# Altium schematic sheet microcontroller.SchDoc: Microcontroller
size A4; Author: Pietro Lorefice; DocumentNumber: 2; Revision: A; SheetNumber: 2; SheetTotal: 3
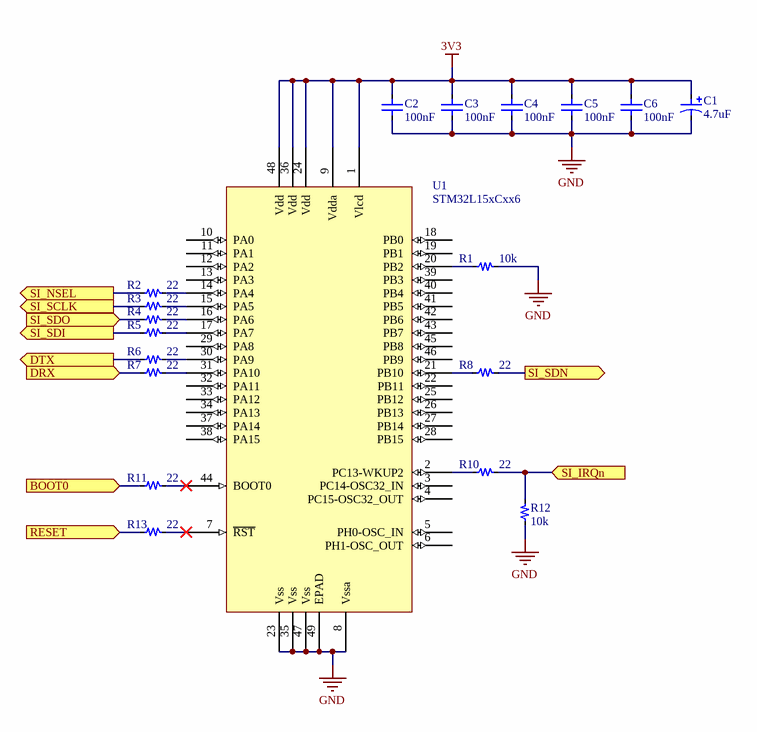
[diagram p0: microcontroller.SchDoc]

## Parts
C1  4.7uF  [0603_[1608]]
C2  100nF  [0402_[1005]]
C3  100nF  [0402_[1005]]
C4  100nF  [0402_[1005]]
C5  100nF  [0402_[1005]]
C6  100nF  [0402_[1005]]
R1  10k  [0402_[1005]]
R2  22  [0402_[1005]]
R3  22  [0402_[1005]]
R4  22  [0402_[1005]]
R5  22  [0402_[1005]]
R6  22  [0402_[1005]]
R7  22  [0402_[1005]]
R8  22  [0402_[1005]]
R10  22  [0402_[1005]]
R11  22  [0402_[1005]]
R12  10k  [0402_[1005]]
R13  22  [0402_[1005]]
U1  STM32L15xCxx6  [QFN50P700X700X60_HS-49N]

## Ports
BOOT0 (in), DRX (in), DTX (out), RESET (in), SI_IRQn (in), SI_NSEL (out), SI_SCLK (out), SI_SDI (out), SI_SDN (out), SI_SDO (in)

## Nets
3V3: C1.1 C2.2 C3.2 C4.2 C5.2 C6.2 U1.1(Vlcd) U1.9(Vdda) U1.24(Vdd) U1.36(Vdd) U1.48(Vdd)
GND: C1.2 C2.1 C3.1 C4.1 C5.1 C6.1 R1.2 R12.1 U1.8(Vssa) U1.23(Vss) U1.35(Vss) U1.47(Vss) U1.49(EPAD)
BOOT0: R11.1 ; port BOOT0
DRX: R7.1 ; port DRX
DTX: R6.1 ; port DTX
RESET: R13.1 ; port RESET
SI_IRQn: R10.2 R12.2 ; port SI_IRQn
SI_NSEL: R2.1 ; port SI_NSEL
SI_SCLK: R3.1 ; port SI_SCLK
SI_SDI: R5.1 ; port SI_SDI
SI_SDN: R8.2 ; port SI_SDN
SI_SDO: R4.1 ; port SI_SDO
NetR1_1: R1.1 U1.20(PB2)
NetR2_2: R2.2 U1.14(PA4)
NetR3_2: R3.2 U1.15(PA5)
NetR4_2: R4.2 U1.16(PA6)
NetR5_2: R5.2 U1.17(PA7)
NetR6_2: R6.2 U1.30(PA9)
NetR7_2: R7.2 U1.31(PA10)
NetR8_1: R8.1 U1.21(PB10)
NetR10_1: R10.1 U1.2(PC13-WKUP2)
NetR11_2: R11.2 U1.44(BOOT0)
NetR13_2: R13.2 U1.7(~{RST})

Not connected (* = marked no-connect by the designer): U1 3(PC14-OSC32_IN) 4(PC15-OSC32_OUT) 5(PH0-OSC_IN) 6(PH1-OSC_OUT) 10(PA0) 11(PA1) 12(PA2) 13(PA3) 18(PB0) 19(PB1) 22(PB11) 25(PB12) 26(PB13) 27(PB14) 28(PB15) 29(PA8) 32(PA11) 33(PA12) 34(PA13) 37(PA14) 38(PA15) 39(PB3) 40(PB4) 41(PB5) 42(PB6) 43(PB7) 45(PB8) 46(PB9)

## Notes on the sheet
- Title
- Project
- Size:
- Date:
- A4
- Number:
- Time:
- Revision:
- Sheet
- of
- Author:

## Library data of the parts
C1 = CPOL: Polarized capacitor; Value: 4.7uF
C2-C6 = C: Capacitor; Value: 100nF
R1-R8 R10-R13 = R: Resistor
  R1 R12: Value: 10k
  R2-R8 R10 R11 R13: Value: 22
U1 = STM32L15xCxx6: Ultra-low-power 32-bit MCU ARM®-based Cortex®-M3, 128KB Flash, 16KB SRAM, 4KB EEPROM, LCD, USB, ADC, DAC